# Altium schematic sheet MachNguyenLy.SchDoc
size A; SheetNumber: 1; SheetTotal: 1
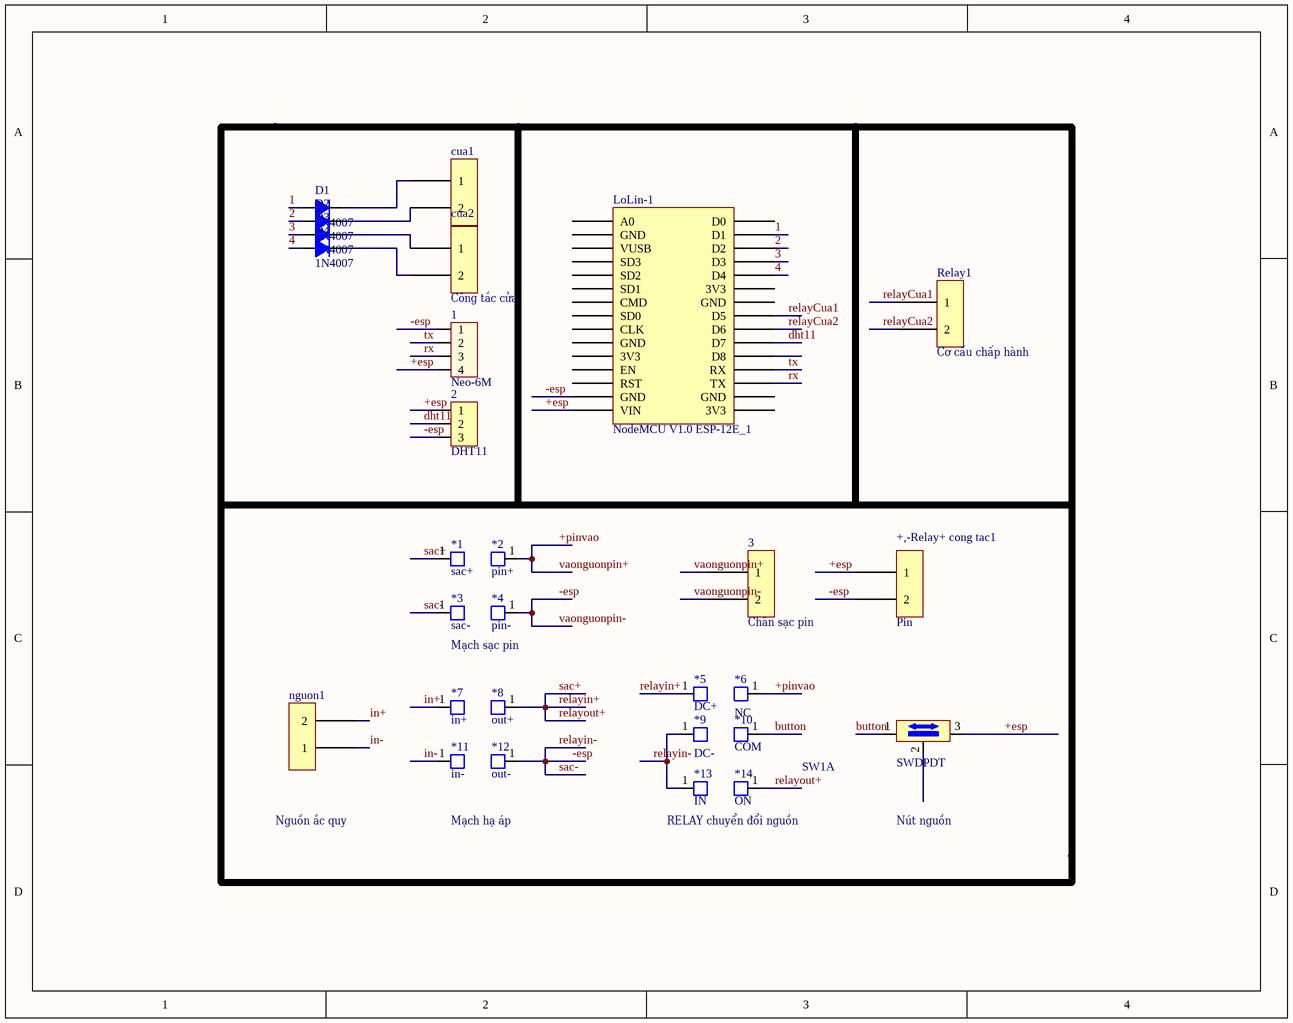
[diagram p0: MachNguyenLy.SchDoc]

## Parts
1  Neo-6M  [CON4]
2  DHT11  [HDR3]
3  Chân sạc pin  [header2_1]
*1  sac+  [VIT OC]
*2  pin+  [VIT OC]
*3  sac-  [VIT OC]
*4  pin-  [VIT OC]
*5  DC+  [VIT OC]
*6  NC  [VIT OC]
*7  in+  [VIT OC]
*8  out+  [VIT OC]
*9  DC-  [VIT OC]
*10  COM  [VIT OC]
*11  in-  [VIT OC]
*12  out-  [VIT OC]
*13  IN  [VIT OC]
*14  ON  [VIT OC]
+,-Relay+_cong_tac1  Pin  [header2_1]
cua1  (no value)  [header2_1]
cua2  Công tắc cửa  [header2_1]
D1  1N4007  [D1A]
D2  1N4007  [D1A]
D3  1N4007  [D1A]
D4  1N4007  [D1A]
LoLin-1  NodeMCU V1.0 ESP-12E_1  [LoLin NodeMcu V3]
nguon1  Nguồn ắc quy  [header2_1]
Relay1  Cơ cấu chấp hành  [header2_1]
SW1  SWDPDT  [SWDPDT_1.5x1]  (part A of 2)

## Nets
1: D1.1(A) LoLin-1.D1
2: D2.1(A) LoLin-1.D2
3: D3.1(A) LoLin-1.D3
4: D4.1(A) LoLin-1.D4
+esp: 1.4 2.1 +,-Relay+_cong_tac1.1 LoLin-1.VIN SW1.3
+pinvao: 3.1 *2.1 *6.1  [also labelled vaonguonpin+]
-esp: 1.1 2.3 3.2 *3.1 *4.1 *9.1 *12.1 *13.1 +,-Relay+_cong_tac1.2 LoLin-1.GND  [also labelled relayin-, sac-, vaonguonpin-]
button: *10.1 SW1.1
dht11: 2.2 LoLin-1.D7
in+: *7.1 nguon1.2
in-: *11.1 nguon1.1
relayCua1: LoLin-1.D5 Relay1.1
relayCua2: LoLin-1.D6 Relay1.2
relayin+: *1.1 *5.1 *8.1 *14.1  [also labelled relayout+, sac+]
rx: 1.3 LoLin-1.TX
tx: 1.2 LoLin-1.RX
Netcua1_1: cua1.1 D1.2(K)
Netcua1_2: cua1.2 D2.2(K)
Netcua2_1: cua2.1 D3.2(K)
Netcua2_2: cua2.2 D4.2(K)

Not connected (* = marked no-connect by the designer): LoLin-1 3V3 A0 CLK CMD D0 D8 EN RST SD0 SD1 SD2 SD3 VUSB; SW1 2

## Notes on the sheet
- Mạch sạc pin
- Mạch hạ áp
- RELAY chuyển đổi nguồn
- Nút nguồn

## Library data of the parts
1 = Con4: Connector 4; Value: Connector 4
2 = Header3: Header IDC, 3 x 1 Pin Vertical 2.54mm Pitch (Non-Boxed, Male); Manufacturer: W¨¹rth Elektronik eiSos GmbH; partNo: 613002143121; ComponentLink1 Description: Manufacturer; ComponentLink2 Description: Datasheet; NoPins: 02; Created Date: 29 March 2013; ComponentLink1URL: http://www.we-online.com; ComponentLink2URL: http://katalog.we-online.de/em/datasheet/6130xx143121.pdf; Created by: Karrer Zheng
3 +,-Relay+_cong_tac1 cua1 cua2 nguon1 Relay1 = header2: ket noi 2 chan 200 mil
*1-*14 = HOLE 1
D1-D4 = Diode 1A: Value: 1N4007
LoLin-1 = NodeMCU V1.0 ESP-12E_1: LoLin NodeMCU V3
SW1 = SWDPDT: Switch SPDT; Creat by: VanDungEvn@Gmail.com